# EAGLE design fonte3 (EAGLE 9.0.1)
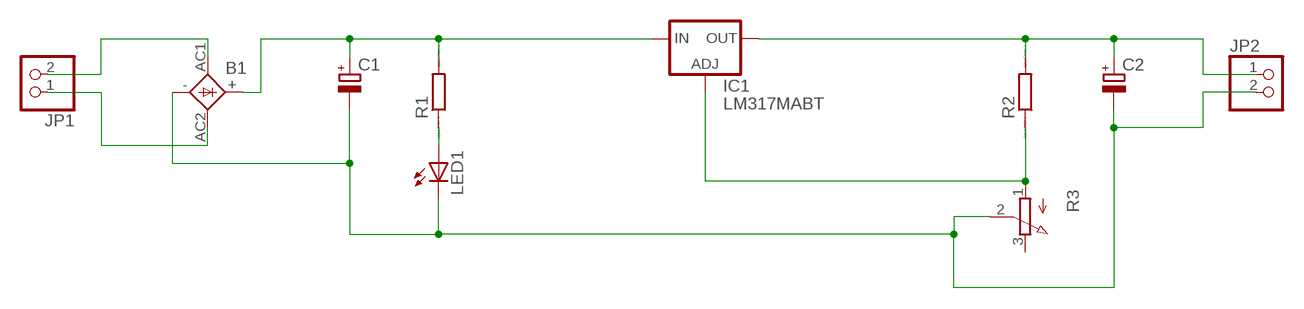
[diagram p0: schematic, sheet 1]

## Parts
B1  1KAB  [1KAB]
C1  CPOL-EUE5-10.5  [E5-10,5]
C2  CPOL-EUE5-10.5  [E5-10,5]
IC1  LM317MABT  [TO220L1]
JP1  PINHD-1X2  [1X02]
JP2  PINHD-1X2  [1X02]
LED1  LED5MM  [LED5MM]
R1  R0207/10  [0207/10]
R2  R0207/10  [0207/10]
R3  3RP/1610N  [3RP/1610N]

## Nets
N$1: B1.AC1 JP1.2
N$2: B1.AC2 JP1.1
N$3: B1.+ C1.+ IC1.3(IN) R1.2
N$5: LED1.A R1.1
N$6: C2.+ IC1.2(OUT) JP2.1 R2.2
N$7: IC1.1(ADJ) R2.1 R3.1(A)
N$9: B1.- C1.- C2.- JP2.2 LED1.K(C) R3.2(S)
Unconnected: R3.3(E)

## Library data of the parts
B1 = rectifier:1KAB: RECTIFIER grid 5,08 x 5,08 mm
C1 C2 = resistor:CPOL-EU: POLARIZED CAPACITOR, European symbol
IC1 = v-reg:LM317?*: 500 mA Adjustable Output Positive Voltage Regulator Source: http://www.onsemi.co.jp .. LM317M-D.PDF
JP1 JP2 = pinhead:PINHD-1X2: PIN HEADER
LED1 = led:LED: LED OSRAM: - CHIPLED LG R971, LG N971, LY N971, LG Q971, LY Q971, LO R971, LY R971 LH N974, LH R974 LS Q976, LO Q976, LY Q976 LO Q996 - Hyper CHIPLED LW Q18S LB Q993, LB Q99A, LB R99A - SideLED LS A670, LO A670, LY A670, LG A670, LP A670 LB A673, LV A673, LT A673, LW A673 LH A674 LY A675 LS A676, LA A676, LO A676, LY A676, LW A676 LS A679, LY A679, LG A679 - Hyper Micro SIDELED® LS Y876, LA Y876, LO Y876, LY Y876 LT Y87S - SmartLED LW L88C, LW L88S LB L89C, LB L89S, LG L890 LS L89K, LO L89K, LY L89K LS L896, LA L896, LO L896, LY L896 - TOPLED LS T670, LO T670, LY T670, LG T670, LP T670 LSG T670, LSP T670, LSY T670, LOP T670, LYG T670 LG T671, LOG T671, LSG T671 LB T673, LV T673, LT T673, LW T673 LH T674 LS T676, LA T676, LO T676, LY T676, LB T676, LH T676, LSB T676, LW T676 LB T67C, LV T67C, LT T67C, LS T67K, LO T67K, LY T67K, LW E67C LS E67B, LA E67B, LO E67B, LY E67B, LB E67C, LV E67C, LT E67C LW T67C LS T679, LY T679, LG T679 LS T770, LO T770, LY T770, LG T770, LP T770 LB T773, LV T773, LT T773, LW T773 LH T774 LS E675, LA E675, LY E675, LS T675 LS T776, LA T776, LO T776, LY T776, LB T776 LHGB T686 LT T68C, LB T68C - Hyper Mini TOPLED® LB M676 - Mini TOPLED Santana® LG M470 LS M47K, LO M47K, LY M47K Source: http://www.osram.convergy.de LUXEON: - LUMILED® LXK2-PW12-R00, LXK2-PW12-S00, LXK2-PW14-U00, LXK2-PW14-V00 LXK2-PM12-R00, LXK2-PM12-S00, LXK2-PM14-U00 LXK2-PE12-Q00, LXK2-PE12-R00, LXK2-PE12-S00, LXK2-PE14-T00, LXK2-PE14-U00 LXK2-PB12-K00, LXK2-PB12-L00, LXK2-PB12-M00, LXK2-PB14-N00, LXK2-PB14-P00, LXK2-PB14-Q00 LXK2-PR12-L00, LXK2-PR12-M00, LXK2-PR14-Q00, LXK2-PR14-R00 LXK2-PD12-Q00, LXK2-PD12-R00, LXK2-PD12-S00 LXK2-PH12-R00, LXK2-PH12-S00 LXK2-PL12-P00, LXK2-PL12-Q00, LXK2-PL12-R00 Source: www.luxeon.com KINGBRIGHT: KA-3528ASYC Source: www.kingbright.com
R1 R2 = eagle-ltspice:R: RESISTOR, European symbol; SPICEMODEL: NONE; SPICEPREFIX: R
R3 = pot:3RP/1610N: 16mm Potentiometer one level Source: http://www.alphapotentiometers.net/html/16mm_pot_2.html

## Board
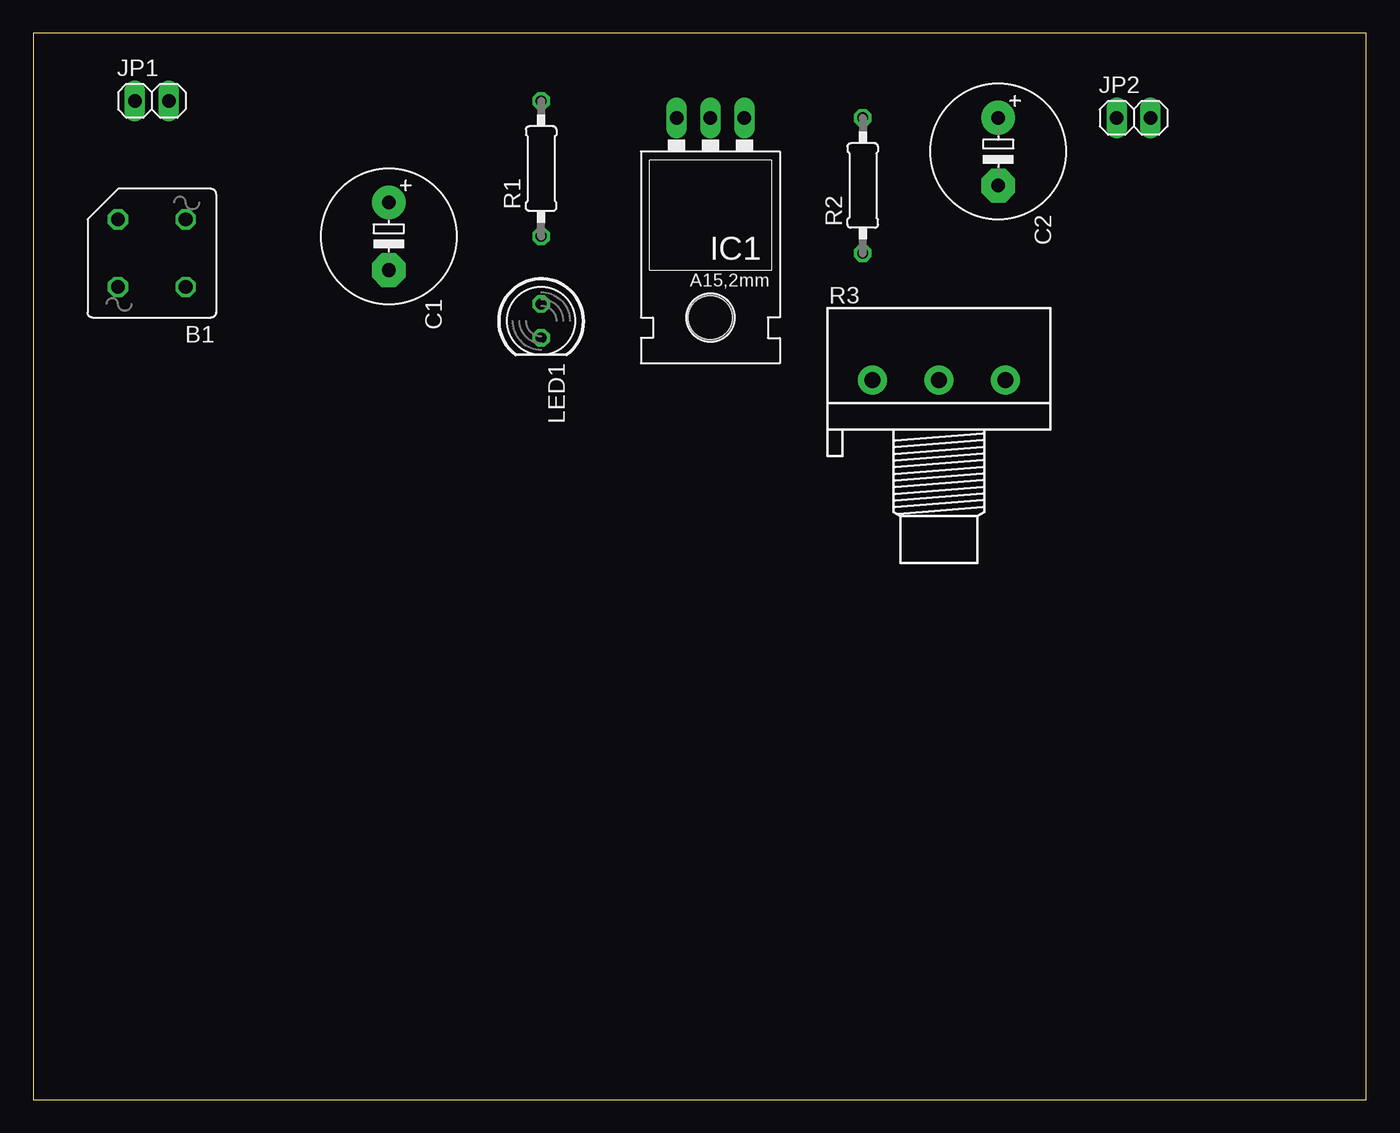
[diagram p1: board, top side]
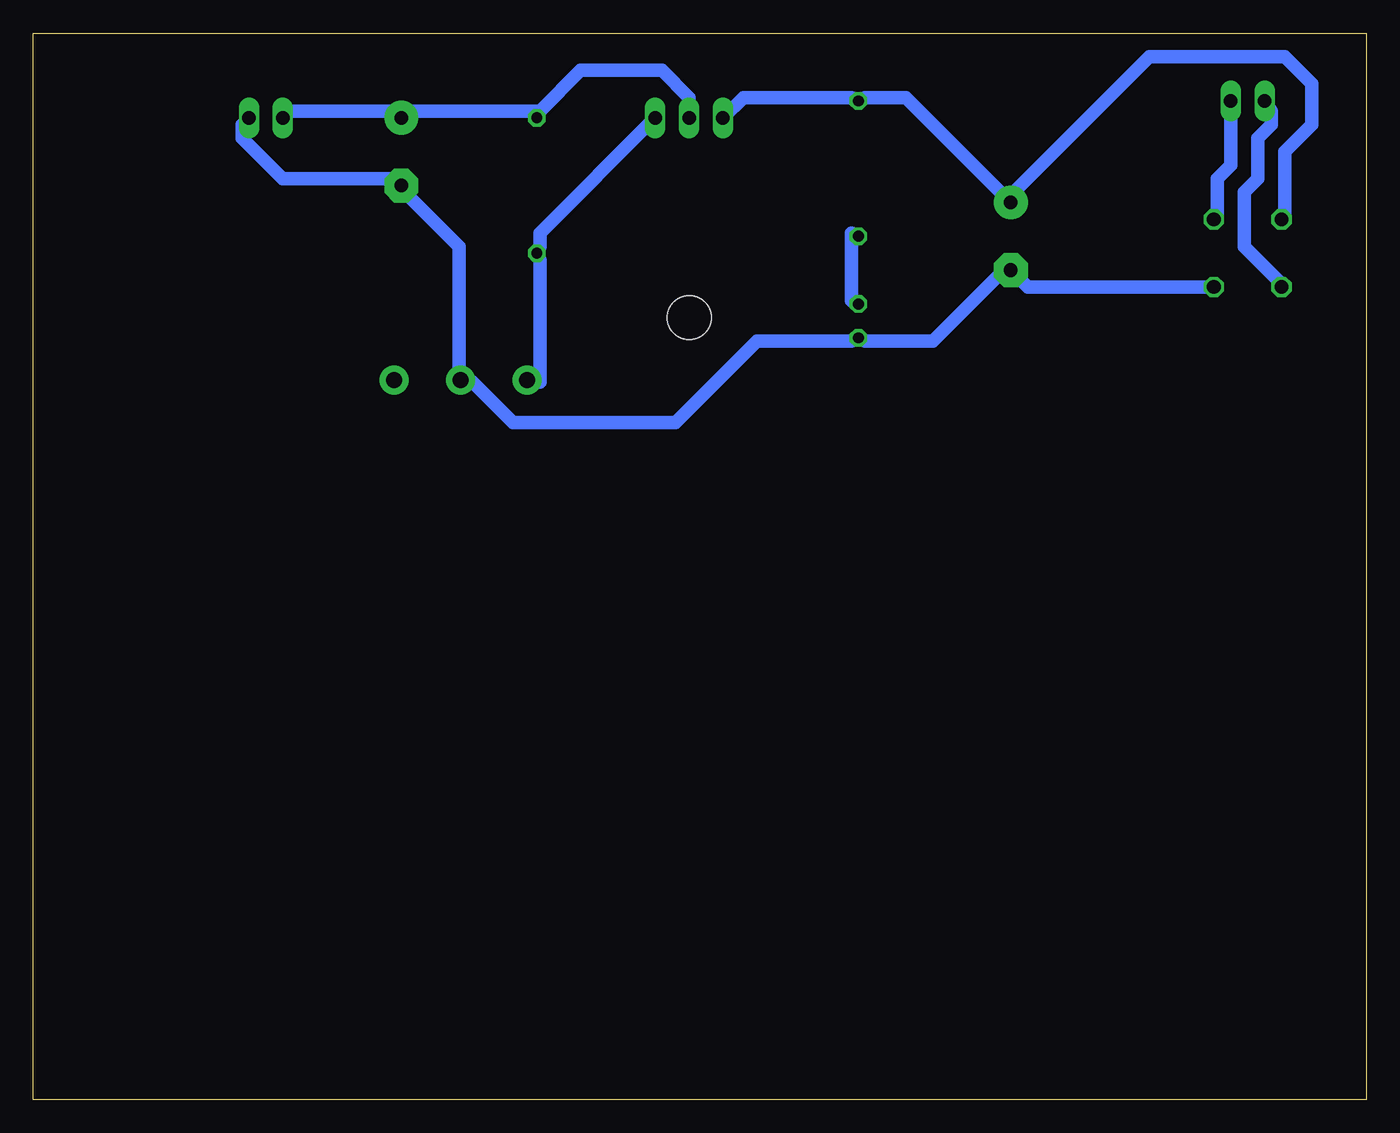
[diagram p2: board, bottom side, seen from below]

Size 100 x 80 mm. Coordinates in mm from the lower left corner, seen from the top.
Outline: 0,0 100,0 100,80 0,80 0,0
Copper layers (1*16): Top 0.035mm / dielectric 1.5mm / Bottom 0.035mm
Design rules "default *": minimum track width 40mil, minimum drill 0.35mm, track to track 40mil, track to pad 40mil, pad to pad 40mil, via to via 40mil, smd to smd 6mil, copper to edge 40mil, drill to drill 6mil, minimum pad ring 10mil, minimum via ring 8mil, stop-mask expansion 4mil, vias tented up to drill 0mil, thermal gap 10mil

### Footprints (pad centres in the part's own frame; a part is rotated, then mirrored left to right if it is on the bottom)
1KAB = drill 1.016 octagon: + 2.54,-2.54; - -2.54,2.54; AC1 -2.54,-2.54; AC2 2.54,2.54
E5-10,5 = drill 1.016 pad 2.54: + -2.54,0 | drill 1.016 pad 2.54 octagon: - 2.54,0
TO220L1 = drill 1.016 long: 1 -2.54,-3.81; 2 0,-3.81; 3 2.54,-3.81 | hole 3.302: 0,11.176
1X02 = drill 1.016 long: 1 -1.27,0; 2 1.27,0
LED5MM = drill 0.813 octagon: A -1.27,0; K 1.27,0
0207/10 = drill 0.813 octagon: 1 -5.08,0; 2 5.08,0
3RP/1610N = drill 1.2 pad 2.184: 1 -5,0; 2 0,0; 3 5,0

### Placement (x,y rotation side)
B1  8.89,63.5 180 top
C1  26.67,64.77 270 top
C2  72.39,71.12 270 top
IC1  50.8,69.85 180 top
JP1  8.89,74.93 0 top
JP2  82.55,73.66 0 top
LED1  38.1,58.42 270 top
R1  38.1,69.85 90 top
R2  62.23,68.58 90 top
R3  67.94,53.98 0 top

### Tracks (layer width: path | path; a pad name or v marks a point on that pad's centre or on a via)
N$1
  Bottom 1.016: JP1.2 10.16,70.1 11.18,69.09 11.18,66.04 B1.AC1
N$2
  Bottom 1.016: B1.AC2 6.1,60.96 9.14,64.01 9.14,68.07 8.13,69.09 8.13,72.14 7.11,73.15 7.11,74.17 JP1.1
N$3
  Bottom 1.016: IC1.3 46.74,75.18 38.61,75.18 R1.2 37.59,75.18 34.54,75.18 C1.+ 26.42,68.07 16.26,78.23 6.1,78.23 4.06,76.2 4.06,73.15 6.1,71.12 6.1,66.04 B1.+
N$5
  Bottom 1.016: LED1.A 38.61,59.94 38.61,65.02 R1.1
N$6
  Bottom 1.016: 61.98,74.17 72.14,74.17 C2.+ 73.15,74.17 81.28,74.17 JP2.1 | IC1.2 50.8,75.18 52.83,77.22 58.93,77.22 61.98,74.17 | 61.98,74.17 R2.2
N$7
  Bottom 1.016: R3.1 61.98,53.85 61.98,62.99 R2.1 61.98,64.01 61.98,65.02 IC1.1
N$9
  Bottom 1.016: 11.18,60.96 B1.- 25.4,60.96 C1.- 27.43,61.98 32.51,56.9 37.59,56.9 LED1.K 38.61,56.9 45.72,56.9 51.82,50.8 64.01,50.8 67.06,53.85 R3.2 68.07,54.86 68.07,64.01 72.14,68.07 C2.- 73.15,69.09 81.28,69.09 84.33,72.14 84.33,73.15 JP2.2